# EAGLE design high-ripple-vcf-en90-11-lm13700s (EAGLE 6.6.0)
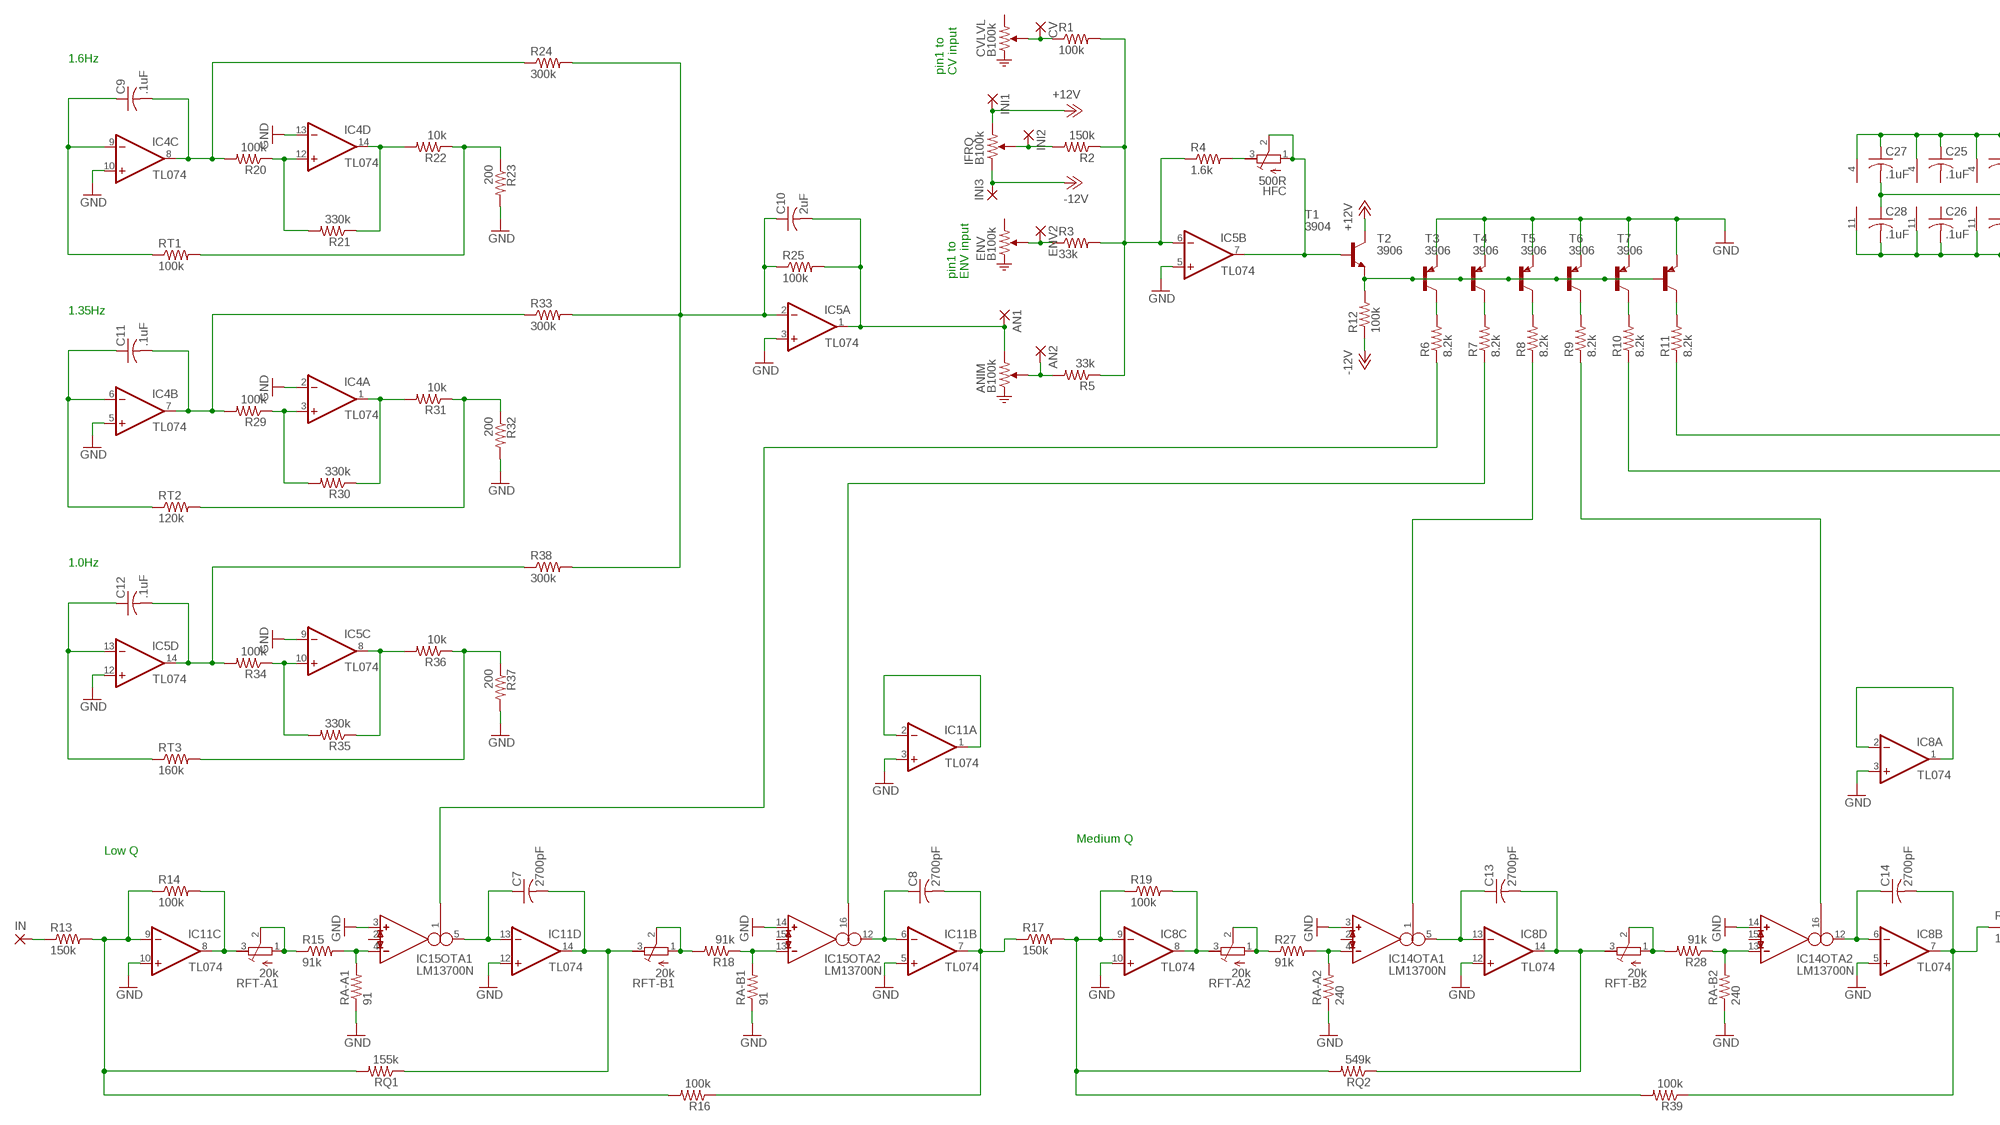
[diagram p0: schematic, sheet 1, part 1 of 2]
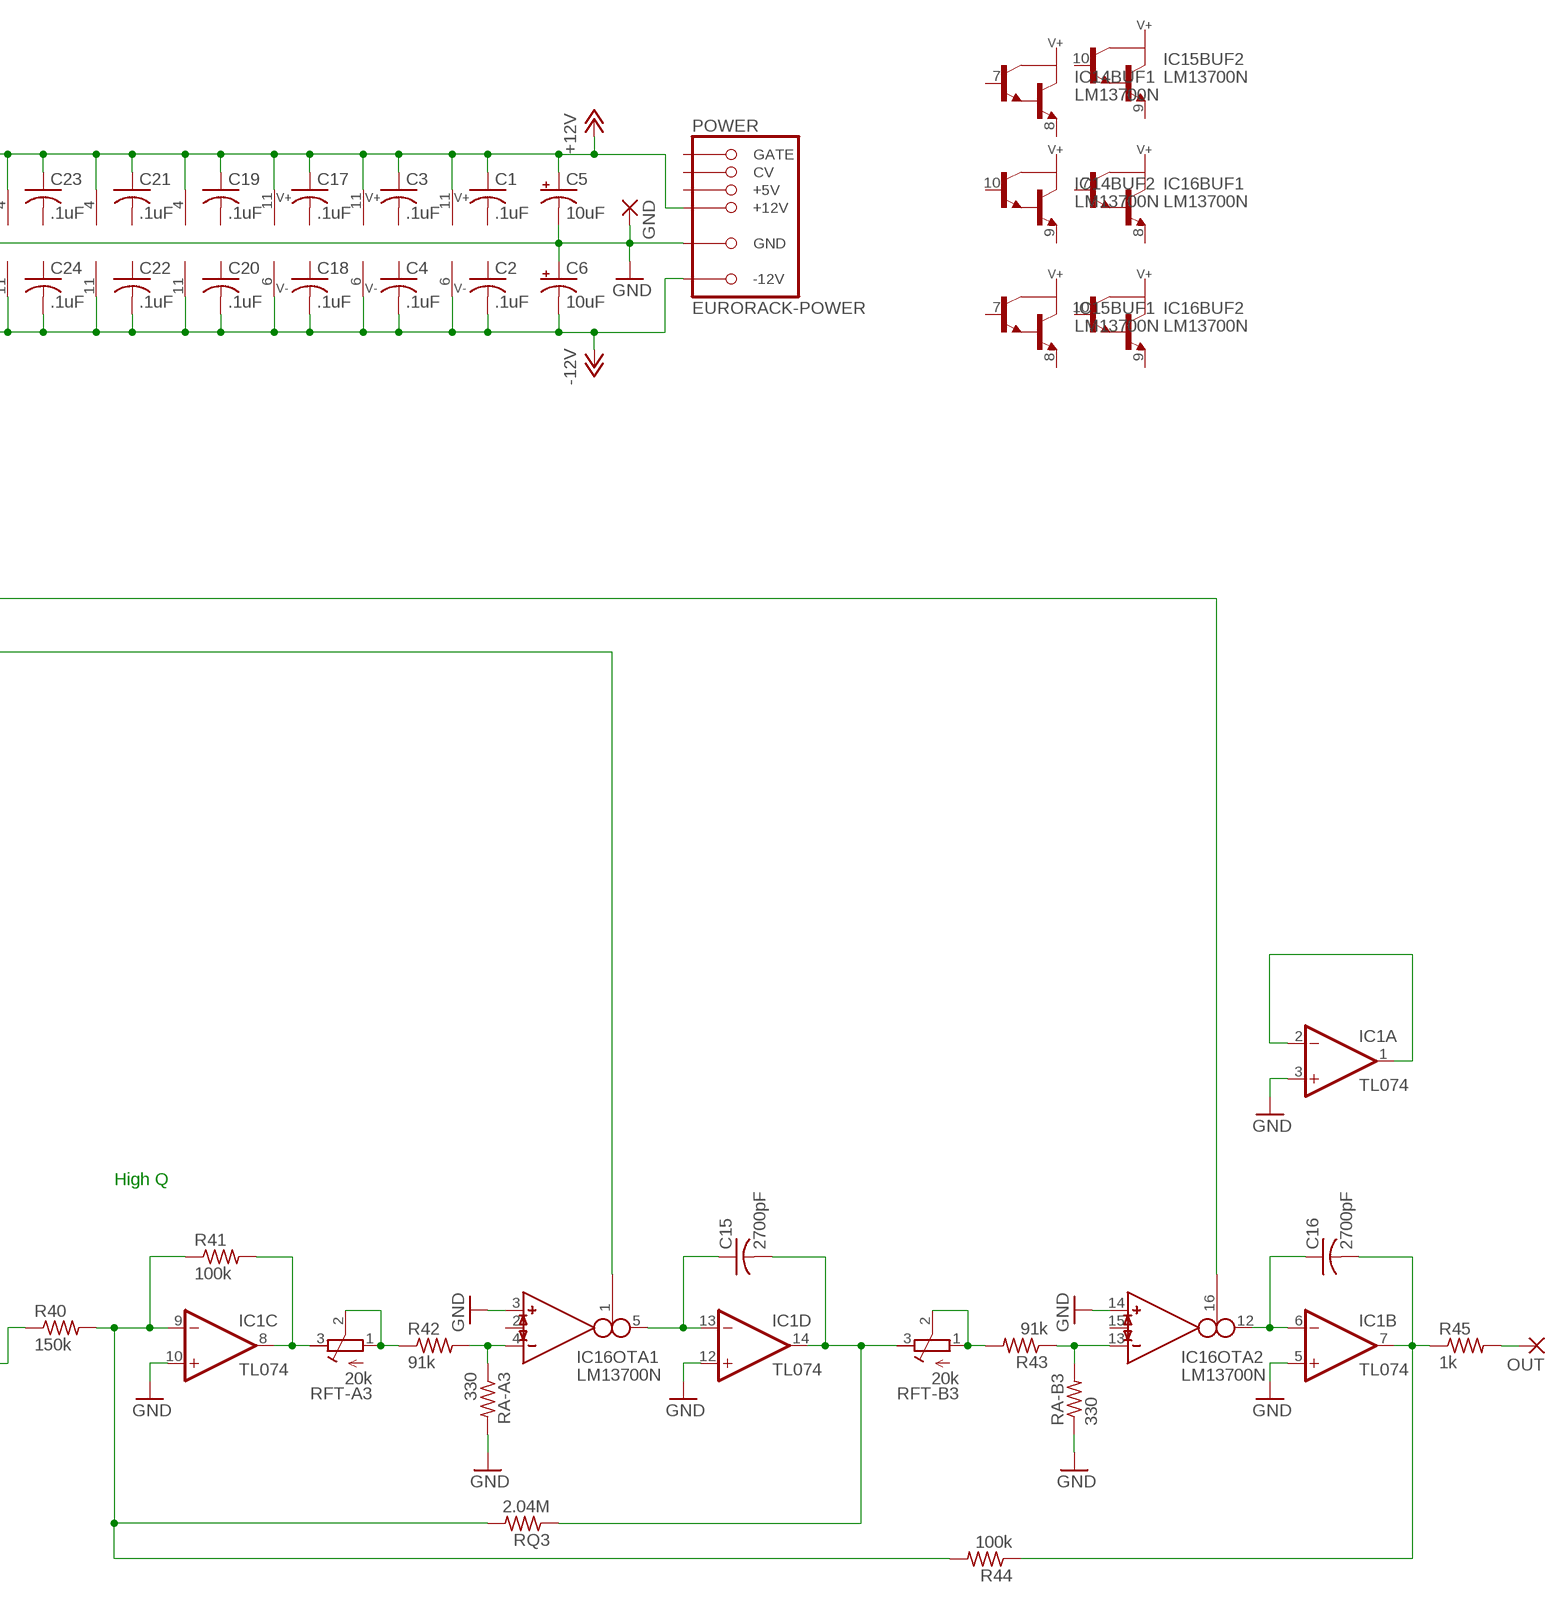
[diagram p1: schematic, sheet 1, part 2 of 2]

## Parts
AN1  2,15/1,0  [2,15/1,0]
AN2  2,15/1,0  [2,15/1,0]
ANIM  B100k  POT-ATTEN  (no package)
C1  .1uF  C-US025-025X050  [C025-025X050]
C2  .1uF  C-US025-025X050  [C025-025X050]
C3  .1uF  C-US025-025X050  [C025-025X050]
C4  .1uF  C-US025-025X050  [C025-025X050]
C5  10uF  CPOL-USE2.5-5  [E2,5-5]
C6  10uF  CPOL-USE2.5-5  [E2,5-5]
C7  2700pF  C-US050-025X075  [C050-025X075]
C8  2700pF  C-US050-025X075  [C050-025X075]
C9  .1uF  C-US025-025X050  [C025-025X050]
C10  2uF  C-US025-025X050  [C025-025X050]
C11  .1uF  C-US025-025X050  [C025-025X050]
C12  .1uF  C-US025-025X050  [C025-025X050]
C13  2700pF  C-US050-025X075  [C050-025X075]
C14  2700pF  C-US050-025X075  [C050-025X075]
C15  2700pF  C-US050-025X075  [C050-025X075]
C16  2700pF  C-US050-025X075  [C050-025X075]
C17  .1uF  C-US025-025X050  [C025-025X050]
C18  .1uF  C-US025-025X050  [C025-025X050]
C19  .1uF  C-US025-025X050  [C025-025X050]
C20  .1uF  C-US025-025X050  [C025-025X050]
C21  .1uF  C-US025-025X050  [C025-025X050]
C22  .1uF  C-US025-025X050  [C025-025X050]
C23  .1uF  C-US025-025X050  [C025-025X050]
C24  .1uF  C-US025-025X050  [C025-025X050]
C25  .1uF  C-US025-025X050  [C025-025X050]
C26  .1uF  C-US025-025X050  [C025-025X050]
C27  .1uF  C-US025-025X050  [C025-025X050]
C28  .1uF  C-US025-025X050  [C025-025X050]
CV  2,15/1,0  [2,15/1,0]
CVLVL  B100k  POT-ATTEN  (no package)
ENV  B100k  POT-ATTEN  (no package)
ENV2  2,15/1,0  [2,15/1,0]
GND  2,15/1,0  [2,15/1,0]
HFC  500R  R-TRIMM64W  [RTRIM64W]
IC1  TL074  TL074-TOPP  [DIL14]
IC4  TL074  TL074-TOPP  [DIL14]
IC5  TL074  TL074-TOPP  [DIL14]
IC8  TL074  TL074-TOPP  [DIL14]
IC11  TL074  TL074-TOPP  [DIL14]
IC14  LM13700N  [DIL16]
IC15  LM13700N  [DIL16]
IC16  LM13700N  [DIL16]
IFRQ  B100k  POT  (no package)
IN  2,15/1,0  [2,15/1,0]
INI1  2,15/1,0  [2,15/1,0]
INI2  2,15/1,0  [2,15/1,0]
INI3  2,15/1,0  [2,15/1,0]
OUT  2,15/1,0  [2,15/1,0]
POWER  EURORACK-POWER  [PINSHRD_PTH_2X8]
R1  100k  R-US_0207/2V  [0207/2V]
R2  150k  R-US_0207/2V  [0207/2V]
R3  33k  R-US_0207/2V  [0207/2V]
R4  1.6k  R-US_0207/2V  [0207/2V]
R5  33k  R-US_0207/2V  [0207/2V]
R6  8.2k  R-US_0207/2V  [0207/2V]
R7  8.2k  R-US_0207/2V  [0207/2V]
R8  8.2k  R-US_0207/2V  [0207/2V]
R9  8.2k  R-US_0207/2V  [0207/2V]
R10  8.2k  R-US_0207/2V  [0207/2V]
R11  8.2k  R-US_0207/2V  [0207/2V]
R12  100k  R-US_0207/2V  [0207/2V]
R13  150k  R-US_0207/10  [0207/10]
R14  100k  R-US_0207/2V  [0207/2V]
R15  91k  R-US_0207/2V  [0207/2V]
R16  100k  R-US_0207/10  [0207/10]
R17  150k  R-US_0207/2V  [0207/2V]
R18  91k  R-US_0207/10  [0207/10]
R19  100k  R-US_0207/2V  [0207/2V]
R20  100k  R-US_0207/10  [0207/10]
R21  330k  R-US_0207/2V  [0207/2V]
R22  10k  R-US_0207/2V  [0207/2V]
R23  200  R-US_0207/2V  [0207/2V]
R24  300k  R-US_0207/10  [0207/10]
R25  100k  R-US_0207/2V  [0207/2V]
R27  91k  R-US_0207/2V  [0207/2V]
R28  91k  R-US_0207/10  [0207/10]
R29  100k  R-US_0207/10  [0207/10]
R30  330k  R-US_0207/2V  [0207/2V]
R31  10k  R-US_0207/2V  [0207/2V]
R32  200  R-US_0207/2V  [0207/2V]
R33  300k  R-US_0207/2V  [0207/2V]
R34  100k  R-US_0207/10  [0207/10]
R35  330k  R-US_0207/2V  [0207/2V]
R36  10k  R-US_0207/2V  [0207/2V]
R37  200  R-US_0207/2V  [0207/2V]
R38  300k  R-US_0207/10  [0207/10]
R39  100k  R-US_0207/10  [0207/10]
R40  150k  R-US_0207/2V  [0207/2V]
R41  100k  R-US_0207/2V  [0207/2V]
R42  91k  R-US_0207/2V  [0207/2V]
R43  91k  R-US_0207/10  [0207/10]
R44  100k  R-US_0207/10  [0207/10]
R45  1k  R-US_0207/5V  [0207/5V]
RA-A1  91  R-US_0207/2V  [0207/2V]
RA-A2  240  R-US_0207/2V  [0207/2V]
RA-A3  330  R-US_0207/2V  [0207/2V]
RA-B1  91  R-US_0207/2V  [0207/2V]
RA-B2  240  R-US_0207/2V  [0207/2V]
RA-B3  330  R-US_0207/2V  [0207/2V]
RFT-A1  20k  R-TRIMM64W  [RTRIM64W]
RFT-A2  20k  R-TRIMM64W  [RTRIM64W]
RFT-A3  20k  R-TRIMM64W  [RTRIM64W]
RFT-B1  20k  R-TRIMM64W  [RTRIM64W]
RFT-B2  20k  R-TRIMM64W  [RTRIM64W]
RFT-B3  20k  R-TRIMM64W  [RTRIM64W]
RQ1  155k  R-US_0207/10  [0207/10]
RQ2  549k  R-US_0207/10  [0207/10]
RQ3  2.04M  R-US_0207/10  [0207/10]
RT1  100k  R-US_0207/2V  [0207/2V]
RT2  120k  R-US_0207/2V  [0207/2V]
RT3  160k  R-US_0207/2V  [0207/2V]
T1  3904  2N3904-NPN-TO92-EBC  [TO92-EBC]
T2  3906  2N3906-PNP-TO92-EBC  [TO92-EBC]
T3  3906  2N3906-PNP-TO92-EBC  [TO92-EBC]
T4  3906  2N3906-PNP-TO92-EBC  [TO92-EBC]
T5  3906  2N3906-PNP-TO92-EBC  [TO92-EBC]
T6  3906  2N3906-PNP-TO92-EBC  [TO92-EBC]
T7  3906  2N3906-PNP-TO92-EBC  [TO92-EBC]

## Nets
+12V: C1.1 C3.1 C5.+ C17.1 C19.1 C21.1 C23.1 C25.1 C27.1 IC1.4(P:V+) IC4.4(P:V+) IC5.4(P:V+) IC8.4(P:V+) IC11.4(P:V+) IC14.11 IC15.11 IC16.11 IFRQ.1 INI1.1(P) POWER.+12V@1(+12V) POWER.+12V@2(+12V) T1.C
-12V: C2.2 C4.2 C6.- C18.2 C20.2 C22.2 C24.2 C26.2 C28.2 IC1.11(P:V-) IC4.11(P:V-) IC5.11(P:V-) IC8.11(P:V-) IC11.11(P:V-) IC14.6 IC15.6 IC16.6 IFRQ.3 INI3.1(P) POWER.-12V@1(-12V) POWER.-12V@2(-12V) R12.1
A: IC15.1(OTA1:I_BIAS) R6.1
B: IC15.16(OTA2:I_BIAS) R7.1
C: IC14.1(OTA1:I_BIAS) R8.1
D: IC14.16(OTA2:I_BIAS) R9.1
E: IC16.1(OTA1:I_BIAS) R10.1
GND: C5.- C6.+ C27.2 C28.1 GND.1(P) IC1.3(A:+IN) IC1.5(B:+IN) IC1.10(C:+IN) IC1.12(D:+IN) IC4.2(A:-IN) IC4.5(B:+IN) IC4.10(C:+IN) IC4.13(D:-IN) IC5.3(A:+IN) IC5.5(B:+IN) IC5.9(C:-IN) IC5.12(D:+IN) IC8.3(A:+IN) IC8.5(B:+IN) IC8.10(C:+IN) IC8.12(D:+IN) IC11.3(A:+IN) IC11.5(B:+IN) IC11.10(C:+IN) IC11.12(D:+IN) IC14.3(OTA1:IN_P) IC14.14(OTA2:IN_P) IC15.3(OTA1:IN_P) IC15.14(OTA2:IN_P) IC16.3(OTA1:IN_P) IC16.14(OTA2:IN_P) POWER.GND@1(GND) POWER.GND@2(GND) POWER.GND@3(GND) POWER.GND@4(GND) POWER.GND@5(GND) POWER.GND@6(GND) R23.2 R32.2 R37.2 RA-A1.1 RA-A2.1 RA-A3.2 RA-B1.1 RA-B2.1 RA-B3.1 T2.E T3.E T4.E T5.E T6.E T7.E
N$1: C10.1 IC5.2(A:-IN) R24.2 R25.1 R33.2 R38.2
N$2: CV.1(P) CVLVL.2 R1.1
N$3: IFRQ.2 INI2.1(P) R2.2
N$4: ENV2.1(P) ENV.2 R3.1
N$5: AN2.1(P) ANIM.2 R5.2
N$6: IC5.6(B:-IN) R1.2 R2.1 R3.2 R4.1 R5.1
N$7: HFC.3(E) R4.2
N$8: HFC.1(A) HFC.2(S) IC5.7(B:OUT) T1.B
N$9: R12.2 T1.E T2.B T3.B T4.B T5.B T6.B T7.B
N$10: R6.2 T2.C
N$11: R7.2 T3.C
N$12: R8.2 T4.C
N$13: R9.2 T5.C
N$14: R10.2 T6.C
N$15: R11.2 T7.C
N$16: C9.2 IC4.8(C:OUT) R20.2 R24.1
N$17: IC4.12(D:+IN) R20.1 R21.2
N$18: IC4.14(D:OUT) R21.1 R22.2
N$19: R22.1 R23.1 RT1.2
N$20: C11.2 IC4.7(B:OUT) R29.2 R33.1
N$21: C9.1 IC4.9(C:-IN) RT1.1
N$22: IC4.3(A:+IN) R29.1 R30.2
N$23: IC4.1(A:OUT) R30.1 R31.2
N$24: R31.1 R32.1 RT2.2
N$25: C11.1 IC4.6(B:-IN) RT2.1
N$26: C12.2 IC5.14(D:OUT) R34.2 R38.1
N$27: IC5.10(C:+IN) R34.1 R35.2
N$28: IC5.8(C:OUT) R35.1 R36.2
N$29: R36.1 R37.1 RT3.2
N$30: C12.1 IC5.13(D:-IN) RT3.1
N$31: C8.2 IC11.7(B:OUT) R16.1 R17.1
N$32: IC8.8(C:OUT) R19.2 RFT-A2.3(E)
N$33: R27.1 RFT-A2.1(A) RFT-A2.2(S)
N$34: IC14.4(OTA1:IN_N) R27.2 RA-A2.2
N$35: C13.1 IC8.13(D:-IN) IC14.5(OTA1:OUT)
N$36: IC11.8(C:OUT) R14.2 RFT-A1.3(E)
N$37: R15.1 RFT-A1.1(A) RFT-A1.2(S)
N$38: IC15.4(OTA1:IN_N) R15.2 RA-A1.2
N$39: C7.1 IC11.13(D:-IN) IC15.5(OTA1:OUT)
N$40: C7.2 IC11.14(D:OUT) RFT-B1.3(E) RQ1.1
N$41: C13.2 IC8.14(D:OUT) RFT-B2.3(E) RQ2.1
N$42: R18.2 RFT-B1.1(A) RFT-B1.2(S)
N$43: IC15.13(OTA2:IN_N) R18.1 RA-B1.2
N$44: C8.1 IC11.6(B:-IN) IC15.12(OTA2:OUT)
N$45: IC11.9(C:-IN) R13.2 R14.1 R16.2 RQ1.2
N$46: IC11.1(A:OUT) IC11.2(A:-IN)
N$47: R28.2 RFT-B2.1(A) RFT-B2.2(S)
N$48: IC14.13(OTA2:IN_N) R28.1 RA-B2.2
N$49: C14.1 IC8.6(B:-IN) IC14.12(OTA2:OUT)
N$50: IC8.9(C:-IN) R17.2 R19.1 R39.2 RQ2.2
N$51: IC8.1(A:OUT) IC8.2(A:-IN)
N$52: C14.2 IC8.7(B:OUT) R39.1 R40.1
N$53: IC1.8(C:OUT) R41.2 RFT-A3.3(E)
N$54: R42.1 RFT-A3.1(A) RFT-A3.2(S)
N$55: IC16.4(OTA1:IN_N) R42.2 RA-A3.1
N$56: C15.1 IC1.13(D:-IN) IC16.5(OTA1:OUT)
N$57: C15.2 IC1.14(D:OUT) RFT-B3.3(E) RQ3.1
N$58: R43.2 RFT-B3.1(A) RFT-B3.2(S)
N$59: IC16.13(OTA2:IN_N) R43.1 RA-B3.2
N$60: C16.1 IC1.6(B:-IN) IC16.12(OTA2:OUT)
N$61: IC1.9(C:-IN) R40.2 R41.1 R44.2 RQ3.2
N$62: IC1.1(A:OUT) IC1.2(A:-IN)
N$63: C16.2 IC1.7(B:OUT) R44.1 R45.1
N$64: IN.1(P) R13.1
N$65: OUT.1(P) R45.2
N$66: IC16.16(OTA2:I_BIAS) R11.1
X: AN1.1(P) ANIM.1 C10.2 IC5.1(A:OUT) R25.2
Unconnected: C1.2 C2.1 C3.2 C4.1 C17.2 C18.1 C19.2 C20.1 C21.2 C22.1 C23.2 C24.1 C25.2 C26.1 CVLVL.1 ENV.1 IC14.2(OTA1:I_DIODE) IC14.7(BUF1:B) IC14.8(BUF1:E) IC14.9(BUF2:E) IC14.10(BUF2:B) IC14.15(OTA2:I_DIODE) IC15.2(OTA1:I_DIODE) IC15.7(BUF1:B) IC15.8(BUF1:E) IC15.9(BUF2:E) IC15.10(BUF2:B) IC15.15(OTA2:I_DIODE) IC16.2(OTA1:I_DIODE) IC16.7(BUF1:B) IC16.8(BUF1:E) IC16.9(BUF2:E) IC16.10(BUF2:B) IC16.15(OTA2:I_DIODE) POWER.+5V@1(+5V) POWER.+5V@2(+5V) POWER.CV@1(CV) POWER.CV@2(CV) POWER.GATE@1(GATE) POWER.GATE@2(GATE)

## Notes on the sheet
- 1.6Hz
- pin1 to
  CV input
- pin1 to
  ENV input
- 1.35Hz
- 1.0Hz
- High Q
- Medium Q
- Low Q

## Library data of the parts
AN1 AN2 CV ENV2 GND IN INI1-INI3 OUT = wirepad:2,15/1,0: THROUGH-HOLE PAD
ANIM CVLVL ENV = mmoretti:POT-ATTEN
C1-C4 C7-C28 = rcl:C-US: CAPACITOR, American symbol
C5 C6 = rcl:CPOL-US: POLARIZED CAPACITOR, American symbol
HFC RFT-A1-RFT-A3 RFT-B1-RFT-B3 = rcl:R-TRIMM: Trimm resistor
IC1 IC4 IC5 IC8 IC11 = mmoretti:TL074-TOP: OP AMP
IC14-IC16 = mmoretti:LM13700: Dual OTA with buffers
IFRQ = mmoretti:POT
POWER = mmoretti:EURORACK-POWER
R1-R25 R27-R45 RA-A1-RA-A3 RA-B1-RA-B3 RQ1-RQ3 RT1-RT3 = rcl:R-US_: RESISTOR, American symbol
T1 = transistor-neu-to92:*-NPN-: NPN Transistror
T2-T7 = transistor-neu-to92:*-PNP-: PNP Transistror

## Board
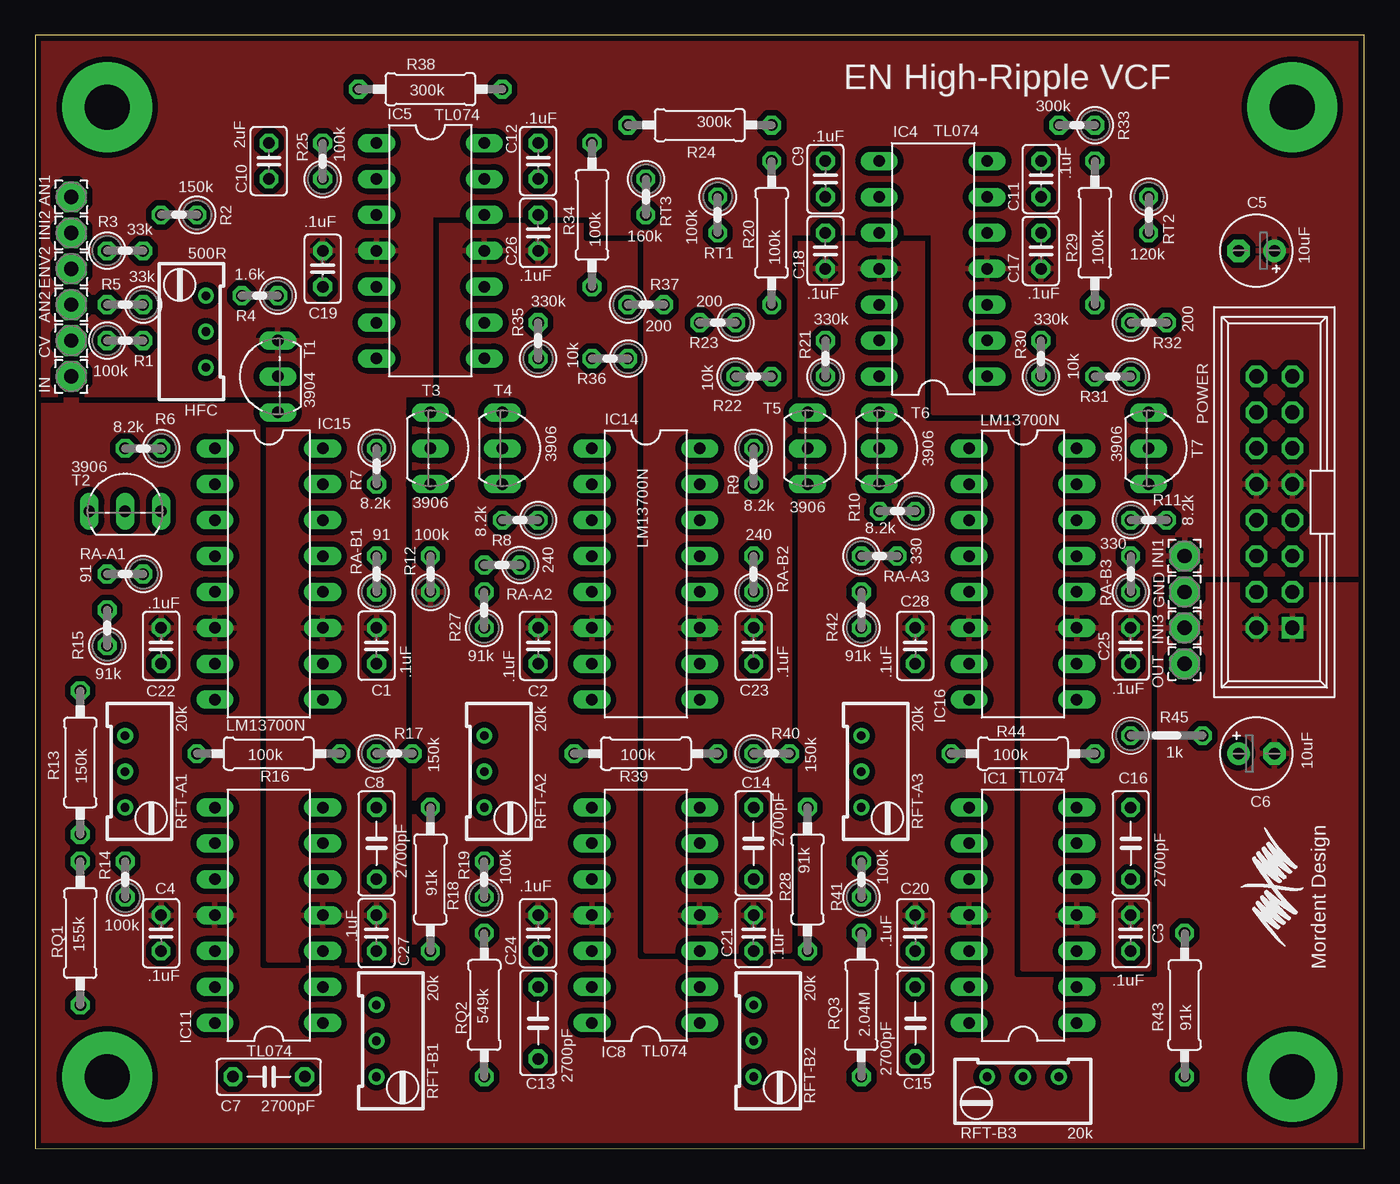
[diagram p2: board, top side]
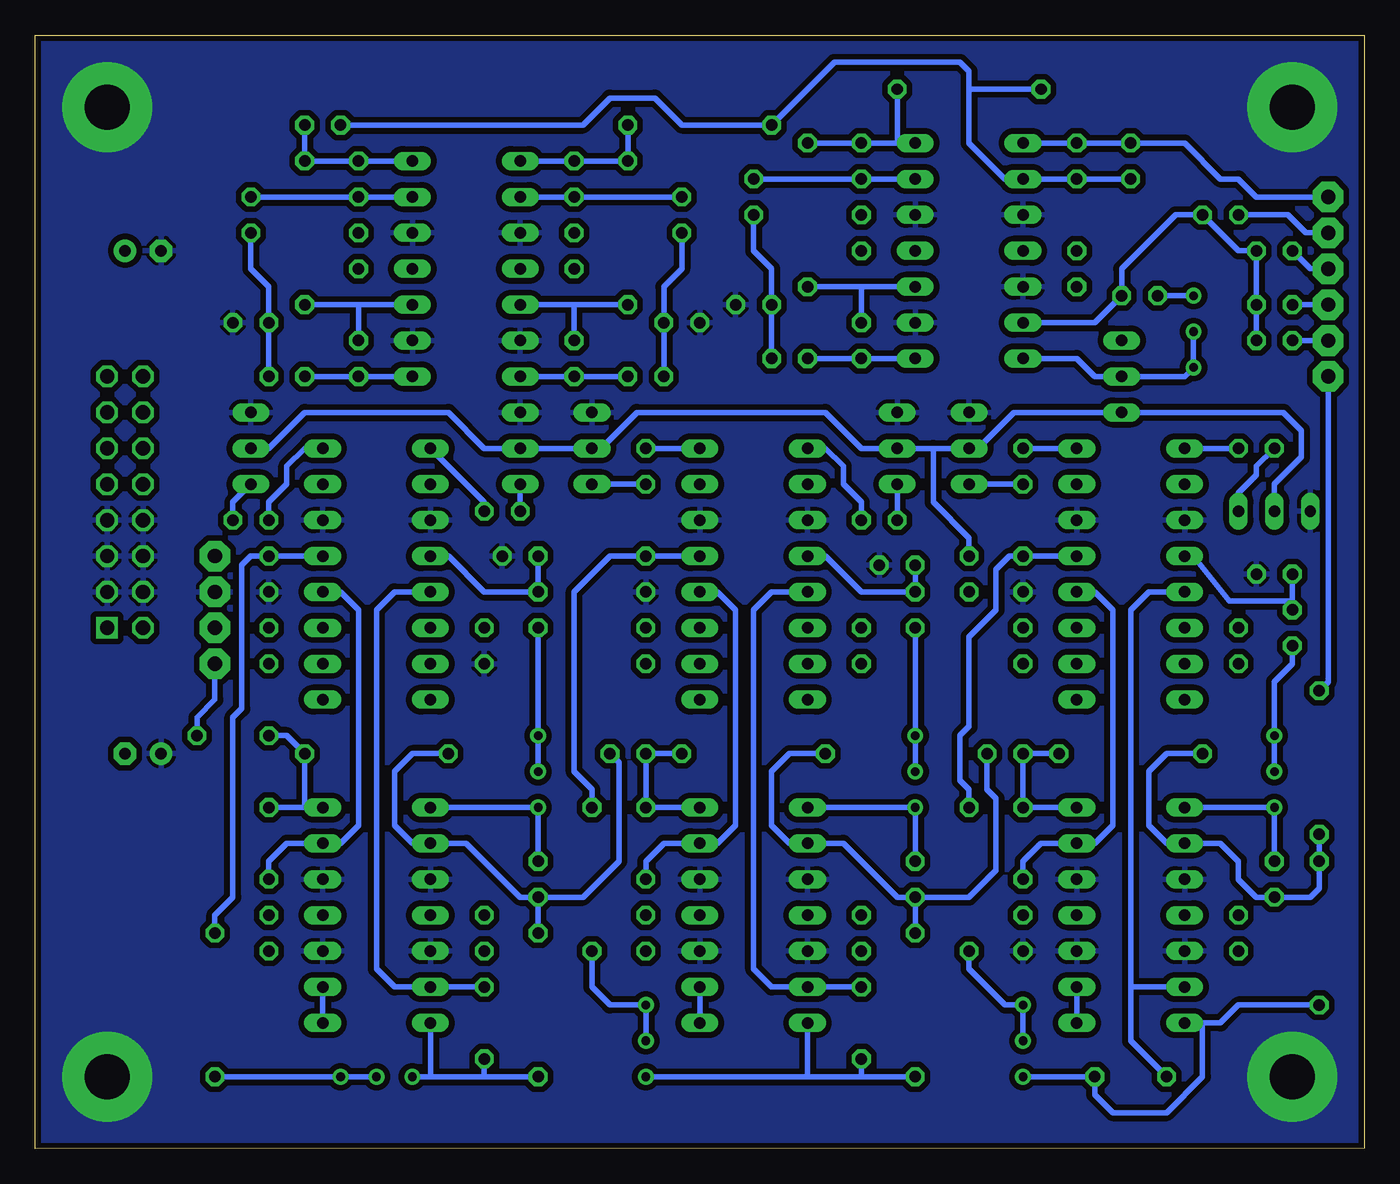
[diagram p3: board, bottom side, seen from below]

Size 93.98 x 78.74 mm. Coordinates in mm from the lower left corner, seen from the top.
Outline: 0,78.74 0,0.02 93.98,0 93.98,78.74 0,78.74
Copper layers (1*16): Top 0.035mm / dielectric 1.5mm / Bottom 0.035mm
Design rules "SeeedStudio_2layer_DRU_no_angle_20140221": minimum track width 6mil, minimum drill 12mil, track to track 6mil, track to pad 6mil, pad to pad 6mil, via to via 6mil, smd to smd 0mil, copper to edge 10mil, drill to drill 10mil, minimum pad ring 10mil, minimum via ring 6mil, stop-mask expansion 2mil, vias tented up to drill 100mil, thermal gap 10mil

### Footprints (pad centres in the part's own frame; a part is rotated, then mirrored left to right if it is on the bottom)
2,15/1,0 = drill 1.016 pad 2.159 octagon: 1 0,0
C025-025X050 = drill 0.813 octagon: 1 -1.27,0; 2 1.27,0
E2,5-5 = drill 0.813 pad 1.6: + -1.27,0 | drill 0.813 pad 1.6 octagon: - 1.27,0
C050-025X075 = drill 0.813 octagon: 1 -2.54,0; 2 2.54,0
RTRIM64W = drill 0.61: 1 1.27,-2.54; 2 1.27,0; 3 1.27,2.54
DIL14 = drill 0.813 long: 1 -7.62,-3.81; 2 -5.08,-3.81; 3 -2.54,-3.81; 4 0,-3.81; 5 2.54,-3.81; 6 5.08,-3.81; 7 7.62,-3.81; 8 7.62,3.81; 9 5.08,3.81; 10 2.54,3.81; 11 0,3.81; 12 -2.54,3.81; 13 -5.08,3.81; 14 -7.62,3.81
DIL16 = drill 0.813 long: 1 -8.89,-3.81; 2 -6.35,-3.81; 3 -3.81,-3.81; 4 -1.27,-3.81; 5 1.27,-3.81; 6 3.81,-3.81; 7 6.35,-3.81; 8 8.89,-3.81; 9 8.89,3.81; 10 6.35,3.81; 11 3.81,3.81; 12 1.27,3.81; 13 -1.27,3.81; 14 -3.81,3.81; 15 -6.35,3.81; 16 -8.89,3.81
PINSHRD_PTH_2X8 = drill 1.016 octagon: +5V@1 3.81,1.27; +5V@2 3.81,-1.27; +12V@1 1.27,1.27; +12V@2 1.27,-1.27; -12V@1 -8.89,1.27; CV@1 6.35,1.27; CV@2 6.35,-1.27; GATE@1 8.89,1.27; GATE@2 8.89,-1.27; GND@1 -6.35,1.27; GND@2 -6.35,-1.27; GND@3 -3.81,1.27; GND@4 -3.81,-1.27; GND@5 -1.27,1.27; GND@6 -1.27,-1.27 | drill 1.016 square: -12V@2 -8.89,-1.27
0207/2V = drill 0.813 octagon: 1 -1.27,0; 2 1.27,0
0207/10 = drill 0.813 octagon: 1 -5.08,0; 2 5.08,0
0207/5V = drill 0.813 octagon: 1 -2.54,0; 2 2.54,0
TO92-EBC = drill 0.813 long: B 0,-1.27; C 2.54,-1.27; E -2.54,-1.27

### Placement (x,y rotation side)
AN1  2.54,67.31 270 top
AN2  2.54,59.69 270 top
C1  24.13,35.56 270 top
C2  35.56,35.56 90 top
C3  77.47,15.24 270 top
C4  8.89,15.24 90 top
C5  86.36,63.5 180 top
C6  86.36,27.94 0 top
C7  16.51,5.08 0 top
C8  24.13,21.59 90 top
C9  55.88,68.58 90 top
C10  16.51,69.85 90 top
C11  71.12,68.58 90 top
C12  35.56,69.85 90 top
C13  35.56,8.89 270 top
C14  50.8,21.59 90 top
C15  62.23,8.89 270 top
C16  77.47,21.59 90 top
C17  71.12,63.5 90 top
C18  55.88,63.5 270 top
C19  20.32,62.23 270 top
C20  62.23,15.24 90 top
C21  50.8,15.24 270 top
C22  8.89,35.56 90 top
C23  50.8,35.56 270 top
C24  35.56,15.24 90 top
C25  77.47,35.56 270 top
C26  35.56,64.77 270 top
C27  24.13,15.24 270 top
C28  62.23,35.56 90 top
CV  2.54,57.15 270 top
ENV2  2.54,62.23 270 top
GND  81.28,39.37 0 top
HFC  10.79,57.78 0 top
IC1  69.85,16.51 90 top
IC4  63.5,62.23 90 top
IC5  27.94,63.5 270 top
IC8  43.18,16.51 90 top
IC11  16.51,16.51 90 top
IC14  43.18,40.64 270 top
IC15  16.51,40.64 270 top
IC16  69.85,40.64 270 top
IN  2.54,54.61 270 top
INI1  81.28,41.91 270 top
INI2  2.54,64.77 270 top
INI3  81.28,36.83 270 top
OUT  81.28,34.29 270 top
POWER  87.63,45.72 90 top
R1  6.35,57.15 0 top
R2  10.16,66.04 180 top
R3  6.35,63.5 0 top
R4  15.88,60.33 180 top
R5  6.35,59.69 180 top
R6  7.62,49.53 180 top
R7  24.13,48.26 270 top
R8  34.29,44.45 180 top
R9  50.8,48.26 270 top
R10  60.96,45.09 180 top
R11  78.74,44.45 0 top
R12  27.94,40.64 90 top
R13  3.17,27.3 270 top
R14  6.35,19.05 90 top
R15  5.08,36.83 90 top
R16  16.51,27.94 180 top
R17  25.4,27.94 0 top
R18  27.94,19.05 270 top
R19  31.75,19.05 90 top
R20  52.07,64.77 90 top
R21  55.88,55.88 90 top
R22  50.8,54.61 0 top
R23  48.26,58.42 180 top
R24  46.99,72.39 180 top
R25  20.32,69.85 90 top
R27  31.75,38.1 90 top
R28  54.61,19.05 270 top
R29  74.93,64.77 90 top
R30  71.12,55.88 90 top
R31  76.2,54.61 180 top
R32  78.74,58.42 0 top
R33  73.66,72.39 180 top
R34  39.37,66.04 90 top
R35  35.56,57.15 90 top
R36  40.64,55.88 180 top
R37  43.18,59.69 0 top
R38  27.94,74.93 180 top
R39  43.18,27.94 180 top
R40  52.07,27.94 0 top
R41  58.42,19.05 90 top
R42  58.42,38.1 90 top
R43  81.28,10.16 270 top
R44  69.85,27.94 180 top
R45  80.01,29.21 0 top
RA-A1  6.35,40.64 180 top
RA-A2  33.02,41.27 180 top
RA-A3  59.69,41.91 0 top
RA-B1  24.13,40.64 90 top
RA-B2  50.8,40.64 90 top
RA-B3  77.47,40.64 90 top
RFT-A1  7.62,26.67 180 top
RFT-A2  33.02,26.67 180 top
RFT-A3  59.69,26.67 180 top
RFT-B1  25.4,7.62 180 top
RFT-B2  52.07,7.62 180 top
RFT-B3  69.85,3.81 90 top
RQ1  3.17,15.24 90 top
RQ2  31.75,10.16 90 top
RQ3  58.42,10.16 90 top
RT1  48.26,66.04 270 top
RT2  78.74,66.04 270 top
RT3  43.18,67.31 270 top
T1  15.88,54.61 90 top
T2  6.35,46.35 0 top
T3  29.21,49.53 270 top
T4  34.29,49.53 270 top
T5  55.88,49.53 270 top
T6  60.96,49.53 270 top
T7  80.01,49.53 270 top

### Tracks (layer width: path | path; a pad name or v marks a point on that pad's centre or on a via)
+12V
  pour Top (isolate 0.406): 93.98,40.64 78.74,40.64 78.74,12.7 69.85,12.7 69.85,52.07 63.5,52.07 63.5,78.74 93.98,78.74
  pour Top (isolate 0.406): 43.18,13.97 53.34,13.97 53.34,78.74 43.18,78.74
  pour Top (isolate 0.406): 63.5,64.77 39.37,64.77 39.37,66.04 27.94,66.04 27.94,78.74 63.5,78.74
  pour Top (isolate 0.406): 27.94,78.74 27.94,57.15 27.94,53.34 26.04,53.34 26.04,43.18 26.04,13.34 16.51,13.34 16.51,53.34 0,53.34 0,78.74
-12V
  pour Top (isolate 0.406, rank 2): 0,78.74 93.98,78.74 93.98,0 0,0
A
  Bottom 0.406: R6.1 IC15.1
B
  Bottom 0.406: R7.1 IC15.16
C
  Bottom 0.406: R8.1 35.56,45.72 36.83,46.99 36.83,48.26 38.1,49.53 IC14.1
D
  Bottom 0.406: R9.1 IC14.16
E
  Bottom 0.406: IC16.1 62.23,45.72 R10.1
GND  (via drill 3.17 pad 6.35)
  other vias: 88.9,73.66 88.9,5.08 5.08,5.08 5.08,73.66
  pour Bottom (isolate 0.406): 0,78.74 93.98,78.74 93.98,0 0,0
N$1
  Bottom 0.406: C10.1 R25.1 IC5.2 25.4,68.58 27.94,71.12 27.94,74.93 | R33.2 55.24,72.39 53.34,74.3 50.16,74.3 48.26,72.39 R24.2 37.47,76.83 28.57,76.83 27.94,76.2 27.94,74.93 | R38.2 27.94,74.93
N$2
  Bottom 0.406: R1.1 CV.1
N$3
  Bottom 0.406: R2.2 5.4,66.04 4.13,64.77 INI2.1
N$4
  Bottom 0.406: R3.1 3.81,62.23 ENV2.1
N$5
  Bottom 0.406: R5.2 AN2.1
N$6
  Bottom 0.406: IC5.6 19.05,58.42 R4.1 17.14,62.23 13.34,66.04 R2.1 8.89,63.5 R3.2 R5.1 R1.2
N$7
  Bottom 0.406: R4.2 HFC.3
N$8
  Bottom 0.406: IC5.7 20.32,55.88 19.05,54.61 T1.B 12.7,54.61 HFC.1 HFC.2
N$9
  Bottom 0.406: T7.B 77.47,49.53 74.93,52.07 64.77,52.07 62.23,49.53 T6.B T5.B 53.98,49.53 51.44,52.07 38.1,52.07 35.56,49.53 T4.B 30.48,49.53 | T2.B 6.35,46.99 4.45,48.9 4.45,50.8 5.71,52.07 T1.E 24.77,52.07 27.3,49.53 T3.B 30.48,49.53 | R12.2 27.94,43.18 30.48,45.72 30.48,49.53
N$10
  Bottom 0.406: T2.C 8.89,46.35 7.62,47.62 7.62,48.26 R6.2
N$11
  Bottom 0.406: T3.C R7.2
N$12
  Bottom 0.406: R8.2 T4.C
N$13
  Bottom 0.406: T5.C R9.2
N$14
  Bottom 0.406: R10.2 T6.C
N$15
  Bottom 0.406: T7.C 80.01,45.72 R11.2
N$16
  Bottom 0.406: IC4.8 C9.2 R20.2 R24.1
N$17
  Bottom 0.406: R20.1 55.88,59.69 | 55.88,59.69 IC4.12 | R21.2 55.88,59.69
N$18
  Bottom 0.406: R22.2 R21.1 IC4.14
N$19
  Bottom 0.406: RT1.2 48.26,62.23 49.53,60.96 R23.1 R22.1
N$20
  Bottom 0.406: R33.1 R29.2 C11.2 IC4.7
N$21
  Bottom 0.406: RT1.1 C9.1 IC4.9
N$22
  Bottom 0.406: R29.1 71.12,59.69 | 71.12,59.69 IC4.3 | R30.2 71.12,59.69
N$23
  Bottom 0.406: IC4.1 R30.1 R31.2
N$24
  Bottom 0.406: RT2.2 78.74,62.23 77.47,60.96 R32.1 R31.1
N$25
  Bottom 0.406: RT2.1 C11.1 IC4.6
N$26
  Bottom 0.406: IC5.14 33.02,71.12 | 33.02,71.12 C12.2 R34.2 | R38.1 33.02,71.12
N$27
  Bottom 0.406: R34.1 35.56,60.96 | 35.56,60.96 IC5.10 | R35.2 35.56,60.96
N$28
  Bottom 0.406: R36.2 R35.1 IC5.8
N$29
  Bottom 0.406: RT3.2 43.18,63.5 41.91,62.23 R37.1 R36.1
N$30
  Bottom 0.406: RT3.1 C12.1 IC5.13
N$31
  Bottom 0.406: IC11.7 C8.2 R17.1 R16.1
N$32
  Bottom 0.406: IC8.8 RFT-A2.3 R19.2
N$33
  Bottom 0.406: R27.1 RFT-A2.1 RFT-A2.2
N$34
  Bottom 0.406: IC14.4 38.1,41.91 35.56,39.37 R27.2 RA-A2.2
N$35
  Bottom 0.406: C13.1 IC8.13 41.91,11.43 43.18,12.7 43.18,38.1 41.91,39.37 IC14.5
N$36
  Bottom 0.406: R14.2 RFT-A1.3 IC11.8
N$37
  Bottom 0.406: R15.1 5.08,34.29 6.35,33.02 RFT-A1.1 RFT-A1.2
N$38
  Bottom 0.406: IC15.4 12.06,41.91 9.53,38.73 5.08,38.73 | 5.08,38.73 R15.2 | RA-A1.2 5.08,38.73
N$39
  Bottom 0.406: IC11.13 16.51,11.43 | 16.51,11.43 16.51,7.62 C7.1 | 16.51,11.43 16.51,38.1 15.24,39.37 IC15.5
N$40
  Bottom 0.406: RFT-B1.3 C7.2 19.05,3.81 17.78,2.54 13.97,2.54 11.43,5.08 11.43,8.89 IC11.14 10.16,8.89 8.89,10.16 RQ1.1
N$41
  Bottom 0.406: RFT-B2.3 39.37,5.08 | 39.37,5.08 35.56,5.08 | 35.56,5.08 RQ2.1 | C13.2 35.56,5.08 | IC8.14 39.37,5.08
N$42
  Bottom 0.406: R18.2 27.94,12.7 25.4,10.16 RFT-B1.1 RFT-B1.2
N$43
  Bottom 0.406: IC15.13 RA-B1.2 25.08,41.91 26.04,40.96 26.04,38.1 27.94,36.2 27.94,29.84 28.57,29.21 28.57,26.04 27.94,25.4 R18.1
N$44
  Bottom 0.406: C8.1 24.13,20.32 22.86,21.59 IC11.6 19.05,21.59 17.78,22.86 17.78,38.1 19.05,39.37 IC15.12
N$45
  Bottom 0.406: R13.2 RQ1.2 3.17,18.41 3.81,17.78 R14.1 7.62,17.78 8.89,19.05 8.89,20.32 10.16,21.59 IC11.9 13.97,21.59 15.24,22.86 15.24,26.67 13.97,27.94 R16.2
N$46
  Bottom 0.406: IC11.2 IC11.1
N$47
  Bottom 0.406: RFT-B2.2 RFT-B2.1 53.34,10.16 54.61,11.43 R28.2
N$48
  Bottom 0.406: R28.1 54.61,25.4 55.88,26.67 55.88,39.37 53.34,41.91 RA-B2.2 IC14.13
N$49
  Bottom 0.406: IC14.12 45.72,39.37 44.45,38.1 44.45,22.86 45.72,21.59 IC8.6 49.53,21.59 50.8,20.32 C14.1
N$50
  Bottom 0.406: R39.2 40.64,27.94 41.91,26.67 41.91,22.86 40.64,21.59 IC8.9 36.83,21.59 33.02,17.78 R19.1 | RQ2.2 R19.1 | R17.2 26.67,25.4 26.04,24.77 26.04,19.68 27.94,17.78 R19.1
N$51
  Bottom 0.406: IC8.2 IC8.1
N$52
  Bottom 0.406: IC8.7 C14.2 R40.1 R39.1
N$53
  Bottom 0.406: IC1.8 RFT-A3.3 R41.2
N$54
  Bottom 0.406: RFT-A3.2 RFT-A3.1 R42.1
N$55
  Bottom 0.406: RA-A3.1 R42.2 62.23,39.37 64.77,41.91 IC16.4
N$56
  Bottom 0.406: IC16.5 68.58,39.37 69.85,38.1 69.85,12.7 68.58,11.43 IC1.13 C15.1
N$57
  Bottom 0.406: RFT-B3.3 66.04,5.08 | 66.04,5.08 62.23,5.08 | 62.23,5.08 RQ3.1 | C15.2 62.23,5.08 | IC1.14 66.04,5.08
N$58
  Bottom 0.406: RFT-B3.2 RFT-B3.1 R43.2
N$59
  Bottom 0.406: IC16.13 RA-B3.2 78.74,41.91 79.38,41.27 79.38,31.11 80.01,30.48 80.01,17.78 81.28,16.51 R43.1
N$60
  Bottom 0.406: C16.1 77.47,20.32 76.2,21.59 IC1.6 72.39,21.59 71.12,22.86 71.12,38.1 72.39,39.37 IC16.12
N$61
  Bottom 0.406: R44.2 67.31,27.94 68.58,26.67 68.58,22.86 67.31,21.59 IC1.9 63.5,21.59 59.69,17.78 R41.1 | RQ3.2 R41.1 | R41.1 55.24,17.78 52.7,20.32 52.7,27.3 R40.2
N$62
  Bottom 0.406: IC1.2 IC1.1
N$63
  Bottom 0.406: C16.2 74.93,24.13 | 74.93,24.13 IC1.7 | 74.93,24.13 R44.1 76.2,29.21 R45.1
N$64
  Bottom 0.406: IN.1 2.54,33.02 R13.1
N$65
  Bottom 0.406: R45.2 82.55,30.48 81.28,31.75 OUT.1
N$66
  Bottom 0.406: R11.1 77.47,45.72 76.2,46.99 76.2,48.26 74.93,49.53 IC16.16
X
  Bottom 0.406: IC5.1 R25.2 C10.2 12.7,71.12 10.16,68.58 8.89,68.58 7.62,67.31 AN1.1

### Text on the board
tPlace: EN High-Ripple VCF | Mordent Design